# EAGLE design rev3 (EAGLE 6.6.0)
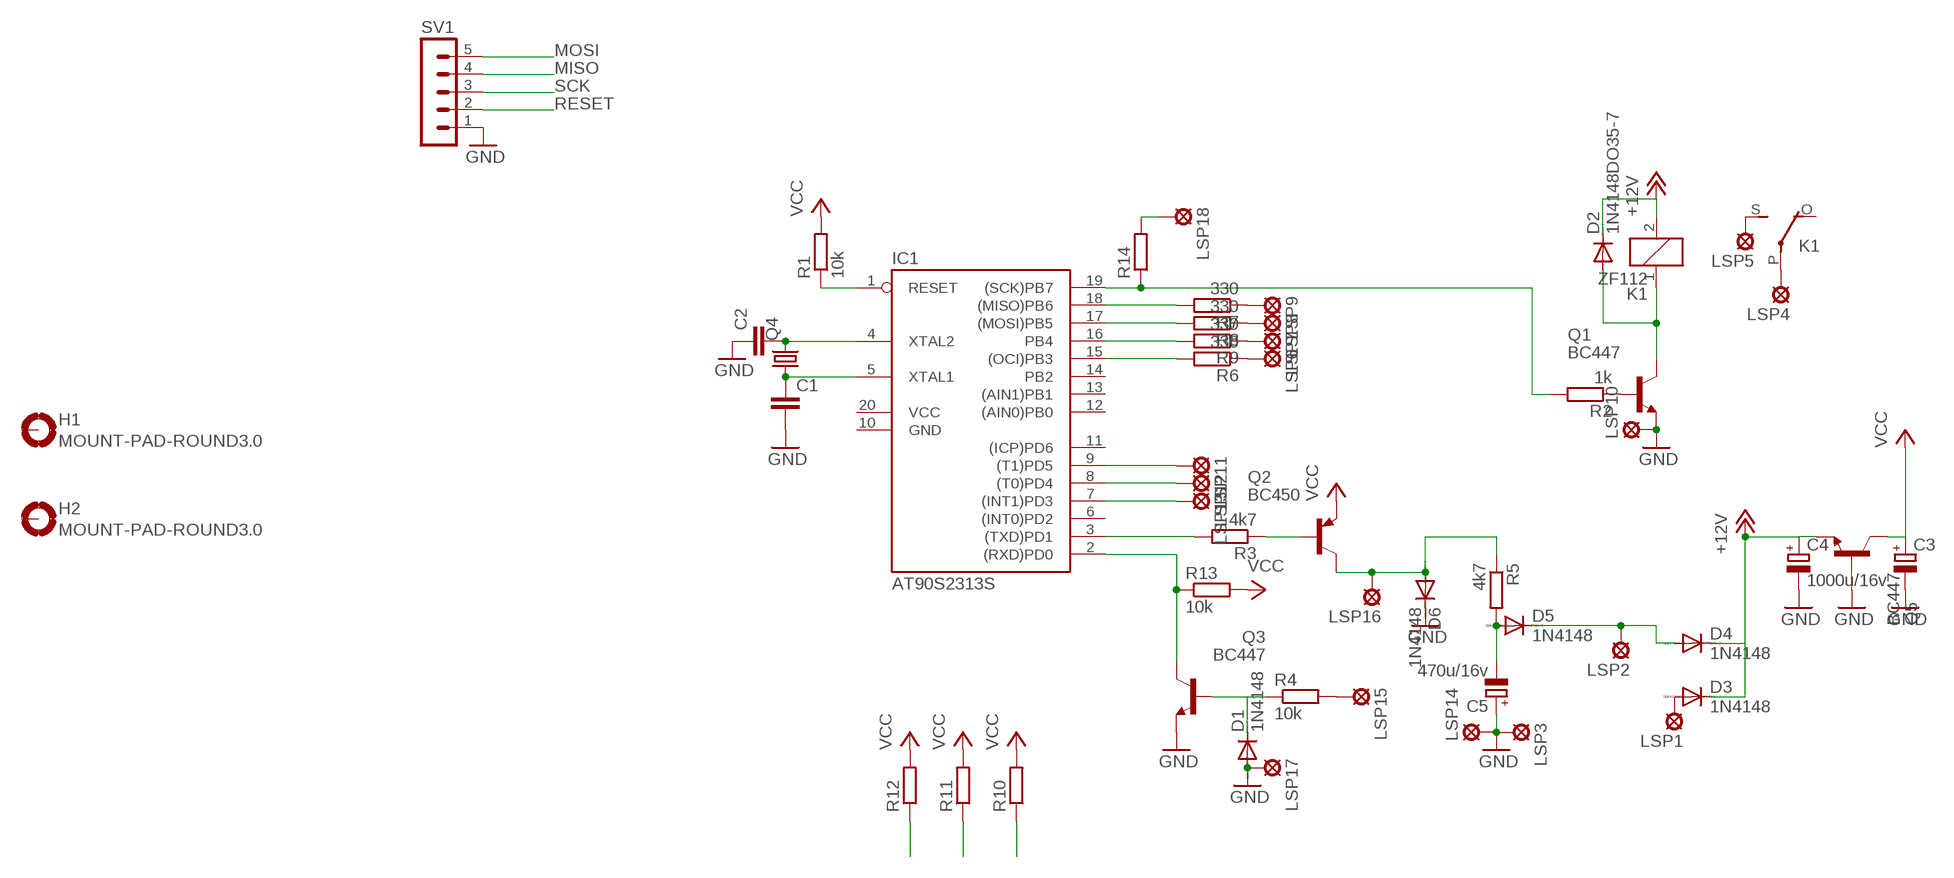
[diagram p0: schematic, sheet 1]

## Parts
C1  C-EU025-025X050  [C025-025X050]
C2  C-EU025-025X050  [C025-025X050]
C3  CPOL-EUE2.5-5  [E2,5-5]
C4  1000u/16v  CPOL-EUE5-6  [E5-6]
C5  470u/16v  CPOL-EUE5-6  [E5-6]
D1  1N4148  1N4148DO35-7  [DO35-7]
D2  1N4148DO35-7  [DO35-7]
D3  1N4148  1N4148DO35-7  [DO35-7]
D4  1N4148  1N4148DO35-7  [DO35-7]
D5  1N4148  1N4148DO35-7  [DO35-7]
D6  1N4148  1N4148DO35-7  [DO35-7]
H1  MOUNT-PAD-ROUND3.0  [3,0-PAD]
H2  MOUNT-PAD-ROUND3.0  [3,0-PAD]
IC1  AT90S2313S  [SO20L]
K1  ZF112  [ZF112]
LSP1  MCS10B  [MCS10B]
LSP2  MCS10B  [MCS10B]
LSP3  MCS10B  [MCS10B]
LSP4  MCS10B  [MCS10B]
LSP5  MCS10B  [MCS10B]
LSP6  MCS10B  [MCS10B]
LSP7  MCS10B  [MCS10B]
LSP8  MCS10B  [MCS10B]
LSP9  MCS10B  [MCS10B]
LSP10  MCS10B  [MCS10B]
LSP11  MCS10B  [MCS10B]
LSP12  MCS10B  [MCS10B]
LSP13  MCS10B  [MCS10B]
LSP14  MCS10B  [MCS10B]
LSP15  MCS10B  [MCS10B]
LSP16  MCS10B  [MCS10B]
LSP17  MCS10B  [MCS10B]
LSP18  MCS10B  [MCS10B]
Q1  BC447  [TO92-EBC]
Q2  BC450  [TO92-EBC]
Q3  BC447  [TO92-EBC]
Q4  CRYSTALHC49S  [HC49/S]
Q5  BC447  [TO92-EBC]
R1  10k  R-EU_0207/7  [0207/7]
R2  1k  R-EU_0207/7  [0207/7]
R3  4k7  R-EU_0207/7  [0207/7]
R4  10k  R-EU_0207/7  [0207/7]
R5  4k7  R-EU_0207/7  [0207/7]
R6  330  R-EU_0207/7  [0207/7]
R7  330  R-EU_0207/7  [0207/7]
R8  330  R-EU_0207/7  [0207/7]
R9  330  R-EU_0207/7  [0207/7]
R10  R-EU_0207/7  [0207/7]
R11  R-EU_0207/7  [0207/7]
R12  R-EU_0207/7  [0207/7]
R13  10k  R-EU_0207/7  [0207/7]
R14  R-EU_0207/10  [0207/10]
SV1  MA05-1  [MA05-1]

## Nets
+12V: C4.+ D2.C D3.C D4.C K1.2 Q5.E
A: IC1.9((T1)PD5) LSP11.MP R10.1
B: IC1.8((T0)PD4) LSP12.MP R11.1
C: IC1.7((INT1)PD3) LSP13.MP R12.1
GND: C1.2 C2.1 C3.- C4.- C5.+ D1.A D6.C LSP3.MP LSP10.MP LSP14.MP LSP17.MP Q1.E Q3.E Q5.B SV1.1
MISO: IC1.18((MISO)PB6) R7.2 SV1.4
MOSI: IC1.17((MOSI)PB5) R8.2 SV1.5
N$1: D6.A LSP16.MP Q2.C R5.1
N$2: C2.2 IC1.4(XTAL2) Q4.2
N$3: C1.1 IC1.5(XTAL1) Q4.1
N$4: D3.A LSP1.MP
N$5: Q1.B R2.1
N$6: Q2.B R3.1
N$7: D1.C Q3.B R4.1
N$8: D2.A K1.1 Q1.C
N$9: IC1.15((OCI)PB3) R6.2
N$10: C5.- D5.A R5.2
N$11: IC1.3((TXD)PD1) R3.2
N$12: IC1.2((RXD)PD0) Q3.C R13.1
N$13: K1.P(2:P) LSP4.MP
N$14: K1.S(2:S) LSP5.MP
N$15: D4.A D5.C LSP2.MP
N$16: IC1.16(PB4) R9.2
N$17: LSP6.MP R6.1
N$18: LSP7.MP R9.1
N$19: LSP8.MP R8.1
N$20: LSP9.MP R7.1
N$21: LSP15.MP R4.2
N$22: LSP18.MP R14.2
RESET: IC1.1(RESET) R1.1 SV1.2
SCK: IC1.19((SCK)PB7) R2.2 R14.1 SV1.3
VCC: C3.+ Q2.E Q5.C R1.2 R10.2 R11.2 R12.2 R13.2
Unconnected: H1.B3,0(MOUNT) H2.B3,0(MOUNT) IC1.6((INT0)PD2) IC1.11((ICP)PD6) IC1.12((AIN0)PB0) IC1.13((AIN1)PB1) IC1.14(PB2) K1.O(2:O)

## Power pins joined to a net without a drawn wire
GND: IC1.10(GND)
VCC: IC1.20(VCC)

## Library data of the parts
C1 C2 = rcl:C-EU: CAPACITOR, European symbol
C3-C5 = rcl:CPOL-EU: POLARIZED CAPACITOR, European symbol
D1-D6 = diode:1N4148: DIODE high speed (Philips)
H1 H2 = holes:MOUNT-PAD-ROUND: MOUNTING PAD, round
IC1 = atmel:AT90S2313: MICROCONTROLLER 2 Kbytes FLASH 128 bytes SRAM 128 bytes EEPROM UART; OC_FARNELL: unknown; OC_NEWARK: unknown
K1 = relay:ZF112: RELAY 1 x switch; OC_FARNELL: unknown; OC_NEWARK: unknown
LSP1-LSP18 = solpad:MCS10B: SOLDER PAD MC S1, distributor Buerklin, 15F505
Q1 Q3 Q5 = transistor-npn:BC447*: NPN Transistor
Q2 = transistor-pnp:BC450*: PNP Transistror
Q4 = crystal:CRYSTAL: CRYSTAL; OC_FARNELL: 1667008; OC_NEWARK: unknown
R1-R14 = rcl:R-EU_: RESISTOR, European symbol
SV1 = con-lstb:MA05-1: PIN HEADER; OC_FARNELL: unknown; OC_NEWARK: unknown

## Board
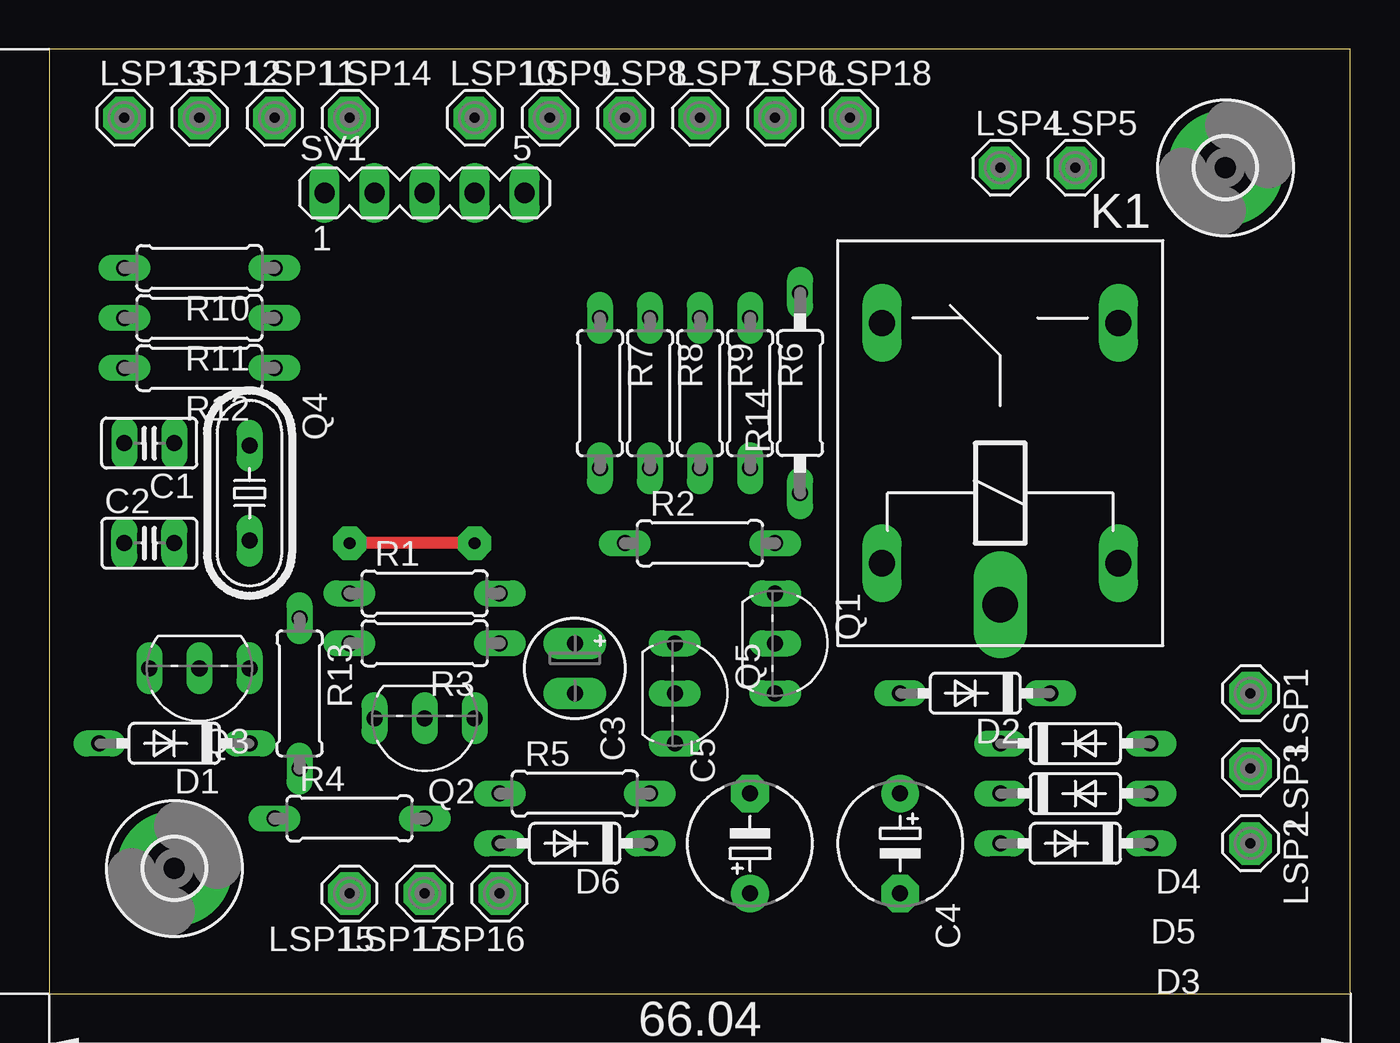
[diagram p1: board, top side]
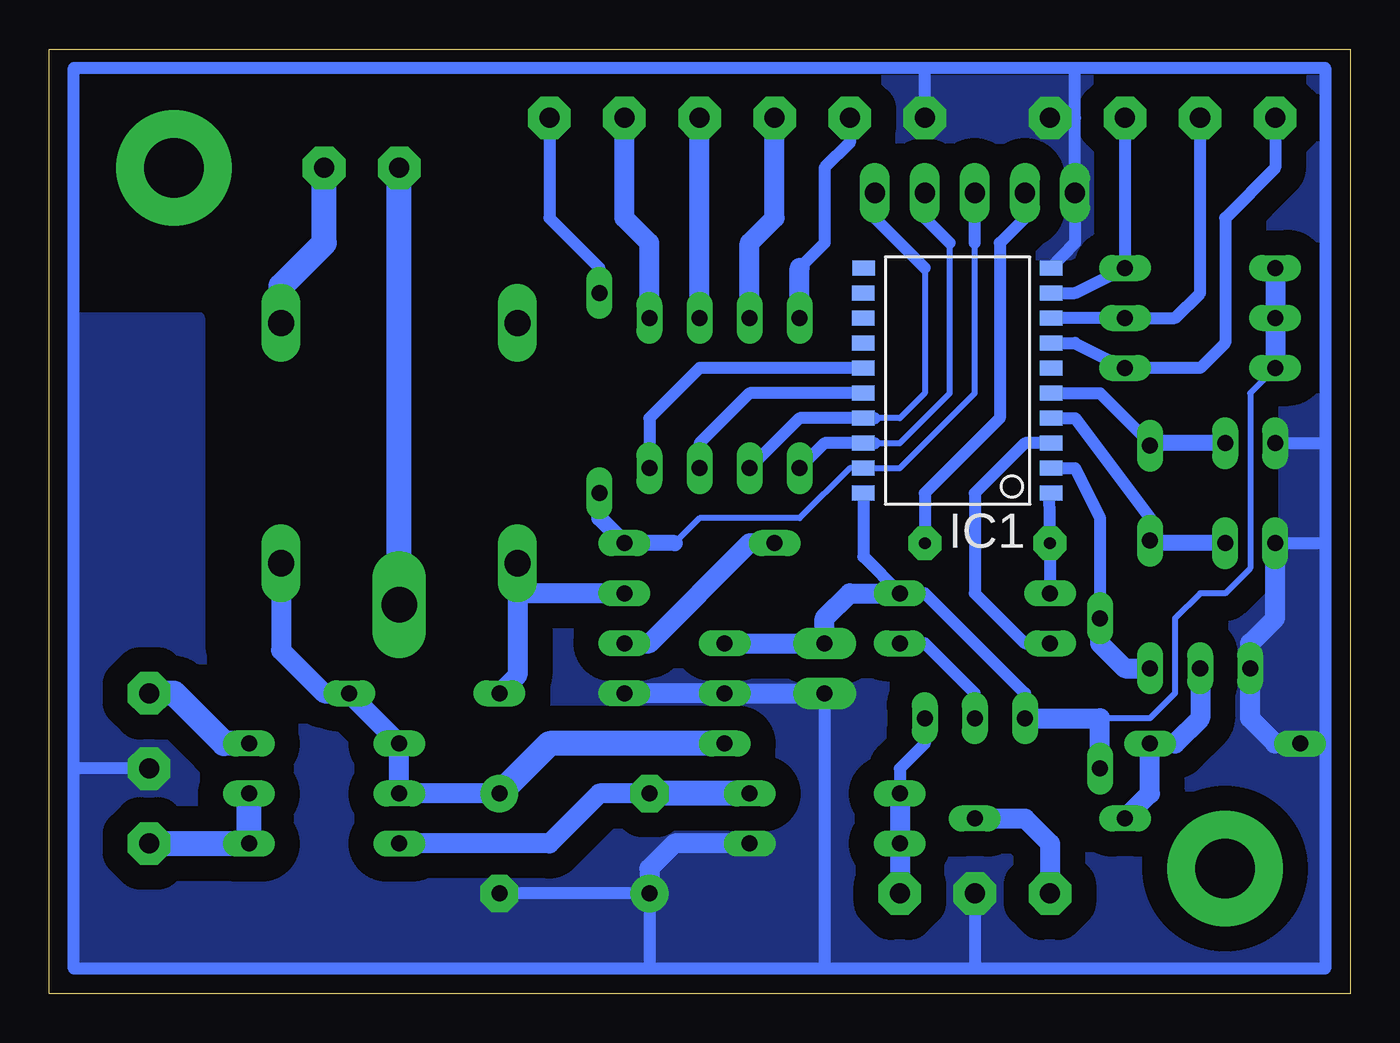
[diagram p2: board, bottom side, seen from below]

Size 66.02 x 47.93 mm. Coordinates in mm from the lower left corner, seen from the top.
Outline: 0,0 66.02,0 66.02,47.93 0,47.93 0,0
Copper layers (1*16): Top 0.035mm / dielectric 1.5mm / Bottom 0.035mm
Design rules "default": minimum track width 10mil, minimum drill 24mil, track to track 8mil, track to pad 8mil, pad to pad 8mil, via to via 8mil, smd to smd 8mil, copper to edge 40mil, drill to drill 8mil, minimum pad ring 10mil, minimum via ring 8mil, stop-mask expansion 4mil, vias tented up to drill 0mil, thermal gap 10mil

### Footprints (pad centres in the part's own frame; a part is rotated, then mirrored left to right if it is on the bottom)
C025-025X050 = drill 0.813 long: 1 -1.27,0; 2 1.27,0
E2,5-5 = drill 0.813 pad 1.6 long: + -1.27,0; - 1.27,0
E5-6 = drill 0.813 pad 1.905: + -2.54,0 | drill 0.813 pad 1.905 octagon: - 2.54,0
DO35-7 = drill 0.813 long: A 3.81,0; C -3.81,0
3,0-PAD = drill 3 pad 5.842: B3,0 0,0
SO20L = smd 0.762 x 1.143: 1 -5.08,-5.131; 2 -3.81,-5.131; 3 -2.54,-5.131; 4 -1.27,-5.131; 5 0,-5.131; 6 1.27,-5.131; 7 2.54,-5.131; 8 3.81,-5.131; 9 5.08,-5.131; 10 6.35,-5.131; 11 6.35,4.369; 12 5.08,4.394; 13 3.81,4.394; 14 2.54,4.394; 15 1.27,4.394; 16 0,4.394; 17 -1.27,4.394; 18 -2.54,4.394; 19 -3.81,4.394; 20 -5.08,4.394
ZF112 = drill 1.321 long: 1 -6.096,5.994; 2 -6.096,-5.994; O 6.096,5.994; S 6.096,-5.994 | drill 1.803 long: P -8.204,0
MCS10B = drill 1.016 pad 2.159 octagon: MP 0,0
TO92-EBC = drill 0.813 long: B 0,-1.27; C -2.54,-1.27; E 2.54,-1.27
HC49/S = drill 0.813 long: 1 -2.413,0; 2 2.413,0
0207/7 = drill 0.813 long: 1 -3.81,0; 2 3.81,0
0207/10 = drill 0.813 long: 1 -5.08,0; 2 5.08,0
MA05-1 = drill 1.016 long: 1 -5.08,0; 2 -2.54,0; 3 0,0; 4 2.54,0; 5 5.08,0

### Placement (x,y rotation side)
C1  5.08,27.94 180 top
C2  5.08,22.86 0 top
C3  26.67,16.51 270 top
C4  43.18,7.62 270 top
C5  35.56,7.62 90 top
D1  6.35,12.7 180 top
D2  46.99,15.24 180 top
D3  52.07,12.7 0 top
D4  52.07,10.16 0 top
D5  52.07,7.62 180 top
D6  26.67,7.62 180 top
H1  6.35,6.35 0 top
H2  59.69,41.91 0 top
IC1  20.32,30.48 90 bottom
K1  48.26,27.94 90 top
LSP1  60.96,15.24 270 top
LSP2  60.96,7.62 270 top
LSP3  60.96,11.43 270 top
LSP4  48.26,41.91 0 top
LSP5  52.07,41.91 0 top
LSP6  36.83,44.45 0 top
LSP7  33.02,44.45 0 top
LSP8  29.21,44.45 0 top
LSP9  25.4,44.45 0 top
LSP10  21.59,44.45 0 top
LSP11  11.43,44.45 0 top
LSP12  7.62,44.45 0 top
LSP13  3.81,44.45 0 top
LSP14  15.24,44.45 0 top
LSP15  15.24,5.08 180 top
LSP16  22.86,5.08 180 top
LSP17  19.05,5.08 180 top
LSP18  40.64,44.45 0 top
Q1  38.1,17.78 270 top
Q2  19.05,12.7 180 top
Q3  7.62,15.24 180 top
Q4  10.16,25.4 270 top
Q5  33.02,15.24 270 top
R1  19.05,20.32 0 top
R2  33.02,22.86 0 top
R3  19.05,17.78 180 top
R4  15.24,8.89 0 top
R5  26.67,10.16 0 top
R6  35.56,30.48 270 top
R7  27.94,30.48 270 top
R8  30.48,30.48 270 top
R9  33.02,30.48 270 top
R10  7.62,36.83 180 top
R11  7.62,34.29 180 top
R12  7.62,31.75 180 top
R13  12.7,15.24 270 top
R14  38.1,30.48 90 top
SV1  19.05,40.64 0 top

### Tracks (layer width: path | path; a pad name or v marks a point on that pad's centre or on a via)
+12V
  Bottom 1.016: K1.2 54.25,17.42 52.07,15.24 D2.C D3.C D4.C C4.+
  Bottom 1.27: Q5.E 40.64,12.7 C4.+
A
  Bottom 0.61: IC1.9 13.97,35.56 R10.1 LSP11.MP
B
  Bottom 0.61: IC1.8 R11.1 8.89,34.29 7.62,35.56 LSP12.MP
C
  Bottom 0.61: IC1.7 13.97,33.02 R12.1 7.62,31.75 6.35,33.02 6.35,39.37 3.81,41.91 LSP13.MP
GND
  Bottom 0.61: 19.05,1.27 1.27,1.27 1.27,22.86 | 19.05,1.27 26.67,1.27 | 26.67,1.27 35.56,1.27 | 35.56,1.27 64.77,1.27 64.77,11.43 | 64.77,11.43 64.77,46.99 21.59,46.99 | 21.59,46.99 13.97,46.99 | 13.97,46.99 1.27,46.99 1.27,27.94 | 1.27,27.94 1.27,22.86 | IC1.10 13.97,38.1 SV1.1 13.97,44.45 | C3.- 26.67,1.27 | 35.56,1.27 C5.+ C4.- | 13.97,44.45 13.97,46.99 | LSP3.MP 64.77,11.43 | LSP10.MP 21.59,46.99 | C2.1 1.27,22.86 | C1.2 1.27,27.94 | LSP14.MP 13.97,44.45 | LSP17.MP 19.05,1.27
  Bottom 1.016: C3.- Q5.B Q1.E | D6.C 34.29,7.62 35.56,6.35 C5.+ | C2.1 3.81,19.05 5.08,17.78 Q3.E 5.08,13.97 3.81,12.7 D1.A
  pour Bottom (isolate 1.27, no thermals): 1.27,46.99 1.27,1.27 64.77,1.27 64.77,34.29 58.42,34.29 58.42,17.78 arc-90 55.88,15.24 44.45,15.24 44.45,45.72 arc90 43.18,46.99
MISO
  Bottom 0.305: 24.13,27.94 22.86,27.94 20.32,30.48 20.32,38.1
  Bottom 0.61: R7.2 26.67,27.94 IC1.18 24.13,27.94 | 20.32,38.1 21.59,39.37 SV1.4
MOSI
  Bottom 0.305: 21.59,36.83 21.59,30.48 22.86,29.21 24.13,29.21
  Bottom 0.61: R8.2 27.94,29.21 IC1.17 24.13,29.21 | SV1.5 24.13,39.37 21.59,36.83
N$1
  Bottom 0.61: Q2.C 21.59,12.7 22.86,11.43 R5.1
  Bottom 1.016: R5.1 D6.A LSP16.MP
N$2
  Bottom 0.61: 15.24,29.21 IC1.4 13.97,29.21 10.16,24.13 Q4.2
  Bottom 0.813: C2.2 10.03,22.86 Q4.2
N$3
  Bottom 0.61: IC1.5 12.7,30.48 10.16,27.94 Q4.1
  Bottom 0.813: C1.1 10.03,27.94 Q4.1
N$4
  Bottom 1.27: D3.A 57.15,12.7 59.69,15.24 LSP1.MP
N$5
  Bottom 1.016: Q1.B 35.56,17.78 30.48,22.86 R2.1
N$6
  Bottom 0.61: Q2.B 19.05,15.24 21.59,17.78 R3.1
N$7
  Bottom 1.016: Q3.B 7.62,13.97 8.89,12.7 D1.C 10.16,10.16 R4.1
N$8
  Bottom 1.016: 42.27,20.32 K1.1 42.01,21.59 | 42.27,20.32 42.27,16.15 D2.A | Q1.C 42.27,20.32
N$9
  Bottom 0.61: IC1.15 33.02,31.75 35.56,29.21 R6.2
N$10
  Bottom 1.016: C5.- 38.1,10.16 40.64,7.62 D5.A
  Bottom 1.27: R5.2 C5.-
N$11
  Bottom 0.61: IC1.3 16.51,27.94 19.05,25.4 19.05,20.32 16.51,17.78 R3.2
N$12
  Bottom 0.61: IC1.2 13.97,26.67 12.7,24.13 R13.1
  Bottom 1.016: R13.1 12.7,17.78 11.43,16.51 Q3.C
N$13
  Bottom 1.27: K1.P LSP4.MP
N$14
  Bottom 1.27: K1.S 54.25,35.92 52.07,38.1 LSP5.MP
N$15
  Bottom 1.27: LSP2.MP D5.C D4.A
N$16
  Bottom 0.61: IC1.16 30.48,30.48 33.02,27.94 R9.2
N$17
  Bottom 1.016: R6.1 35.56,38.1 36.83,39.37 LSP6.MP
N$18
  Bottom 1.016: R9.1 LSP7.MP
N$19
  Bottom 1.016: R8.1 30.48,38.1 29.21,39.37 LSP8.MP
N$20
  Bottom 0.61: LSP9.MP 25.4,43.18 26.67,41.91 26.67,38.1 27.94,36.83
  Bottom 1.016: R7.1 27.94,36.83
N$21
  Bottom 1.016: R4.2 16.51,8.89 15.24,7.62 LSP15.MP
N$22
  Bottom 0.61: LSP18.MP 40.64,39.37 38.1,36.83 R14.2
RESET  (via drill 0.6 pad 1.68)
  Top 0.61: v21.59,22.86 v15.24,22.86
  Bottom 0.61: IC1.1 15.24,25.35 15.29,25.35 v15.24,22.86 R1.1 | SV1.2 16.51,39.37 17.78,38.1 17.78,29.21 21.59,25.4 v21.59,22.86
SCK
  Bottom 0.305: 19.05,38.1 19.05,30.48 22.86,26.67 IC1.19 25.4,26.67 27.94,24.13 33.02,24.13 34.29,22.86
  Bottom 0.61: 19.05,38.1 SV1.3
  Bottom 0.813: 34.29,22.86 R2.2 38.1,24.13 R14.1
VCC
  Bottom 0.305: R12.2 5.08,30.48 5.08,21.59 6.35,20.32 7.62,20.32 8.89,19.05 8.89,15.24 10.16,13.97 12.7,13.97
  Bottom 0.61: IC1.20 24.71,22.17 R1.2 21.59,20.32 16.51,15.24 Q2.E
  Bottom 1.016: R1.2 25.4,20.32 26.67,19.05 C3.+ Q5.C | R10.2 R11.2 R12.2 | Q2.E 12.7,13.97 R13.2